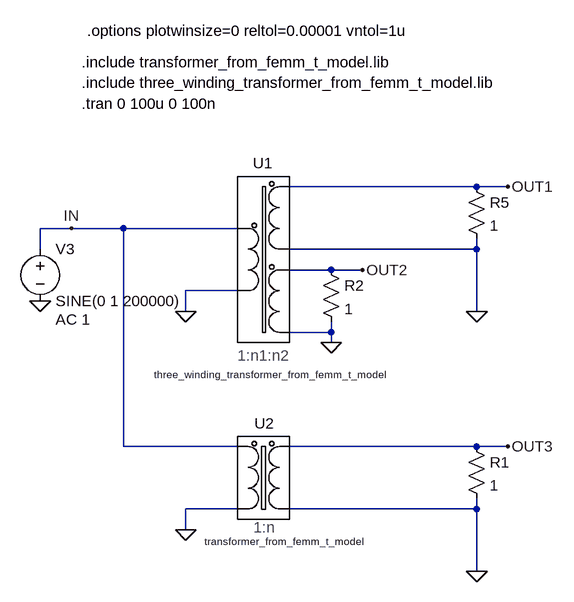
[diagram p0: schematic transformer_test.asc]
transformer_test.asc, the LTspice schematic file:
Version 4
SHEET 1 2508 680
WIRE -64 -32 -352 -32
WIRE -16 -32 -64 -32
WIRE -688 32 -736 32
WIRE -608 32 -688 32
WIRE -432 32 -608 32
WIRE -736 64 -736 32
WIRE -64 64 -64 48
WIRE -64 64 -352 64
WIRE -288 96 -352 96
WIRE -240 96 -288 96
WIRE -432 128 -512 128
WIRE -512 160 -512 128
WIRE -64 160 -64 64
WIRE -288 192 -288 176
WIRE -288 192 -352 192
WIRE -288 208 -288 192
WIRE -608 368 -608 32
WIRE -432 368 -608 368
WIRE -64 368 -352 368
WIRE -16 368 -64 368
WIRE -432 464 -512 464
WIRE -64 464 -64 448
WIRE -64 464 -352 464
WIRE -512 496 -512 464
WIRE -64 560 -64 464
FLAG -736 144 0
FLAG -512 160 0
FLAG -64 160 0
FLAG -688 32 IN
FLAG -16 -32 OUT1
FLAG -288 208 0
FLAG -240 96 OUT2
FLAG -64 560 0
FLAG -16 368 OUT3
FLAG -512 496 0
SYMBOL voltage -736 48 R0
WINDOW 123 24 124 Left 2
WINDOW 39 0 0 Left 0
SYMATTR Value2 AC 1
SYMATTR InstName V3
SYMATTR Value SINE(0 1 200000)
SYMBOL res -80 -48 R0
SYMATTR InstName R5
SYMATTR Value 1
SYMBOL three_winding_transformer_from_femm -416 80 R0
SYMATTR InstName U1
SYMATTR Value three_winding_transformer_from_femm_t_model
SYMBOL transformer_from_femm1 -416 416 R0
WINDOW 3 53 98 Center 1
SYMATTR Value transformer_from_femm_t_model
SYMATTR InstName U2
SYMBOL res -80 352 R0
SYMATTR InstName R1
SYMATTR Value 1
SYMBOL res -304 80 R0
SYMATTR InstName R2
SYMATTR Value 1
TEXT -672 -160 Left 2 !.tran 0 100u 0 100n
TEXT -664 -272 Left 2 !.options plotwinsize=0 reltol=0.00001 vntol=1u
TEXT -672 -192 Left 2 !.include three_winding_transformer_from_femm_t_model.lib
TEXT -672 -224 Left 2 !.include transformer_from_femm_t_model.lib

The netlist it stands for:
* transformer_test.asc
V3 IN 0 SINE(0 1 200000) AC 1
R5 OUT1 0 1
XU1 IN 0 OUT1 0 OUT2 0 three_winding_transformer_from_femm_t_model  ; pins 1 2 3 4 5 6
XU2 IN 0 OUT3 0 transformer_from_femm_t_model  ; pins 1 2 3 4
R1 OUT3 0 1
R2 OUT2 0 1
.tran 0 100u 0 100n
.options plotwinsize=0 reltol=0.00001 vntol=1u
.include three_winding_transformer_from_femm_t_model.lib
.include transformer_from_femm_t_model.lib
.backanno
.end